# Altium schematic sheet Controller.SchDoc
size A3
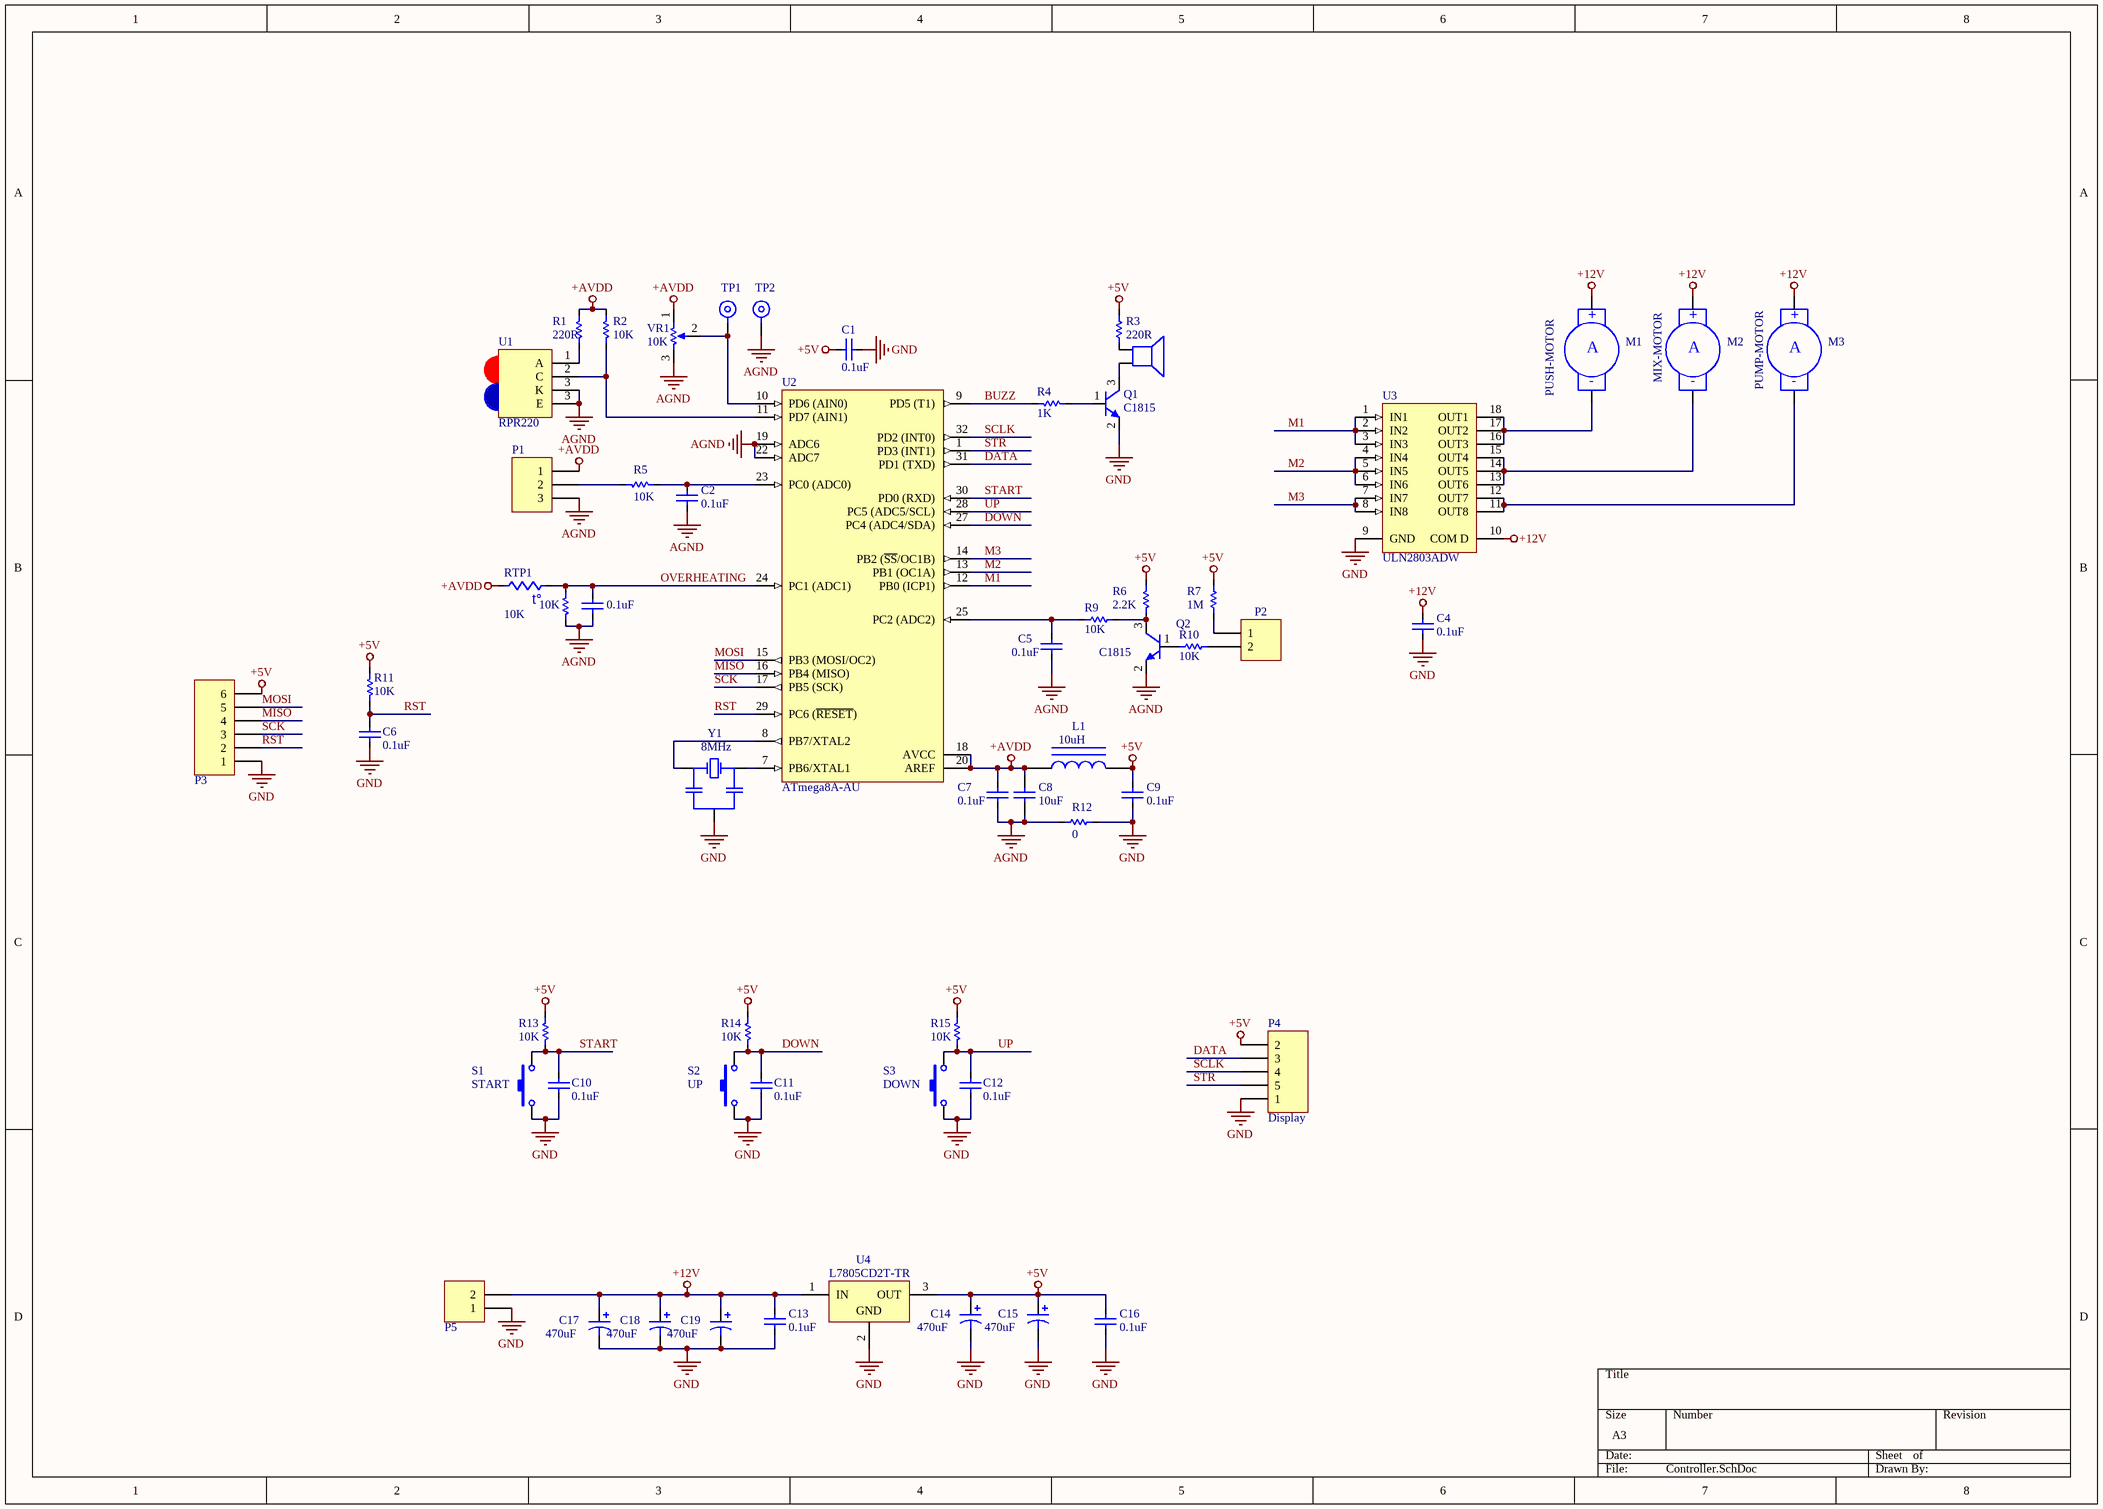
[diagram p0: Controller.SchDoc]

## Parts
C1  0.1uF  [C0805]
C2  0.1uF  [C0805]
C3  0.1uF  [C0805]
C4  0.1uF  [C0805]
C5  0.1uF  [C0805]
C6  0.1uF  [C0805]
C7  0.1uF  [C0805]
C8  10uF  [C0805]
C9  0.1uF  [C0805]
C10  0.1uF  [C0805]
C11  0.1uF  [C0805]
C12  0.1uF  [C0805]
C13  0.1uF  [C0805]
C14  470uF  [CAP-8x11.5]
C15  470uF  [CAP-8x11.5]
C16  0.1uF  [C0805]
C17  470uF  [CAP-8x11.5]
C18  470uF  [CAP-8x11.5]
C19  470uF  [CAP-8x11.5]
L1  10uH  [R0805]
LS1  Buzz  [BUZZ]  (value not drawn)
M1  PUSH-MOTOR  [CONN-2POS-PITCH2.54MM]
M2  MIX-MOTOR  [CONN-2POS-PITCH2.54MM]
M3  PUMP-MOTOR  [CONN-2POS-PITCH2.54MM]
P1  Header 3  [CONN-3POS-PITCH2.54MM]  (value not drawn)
P2  AC-PWR  [CONN-2POS-PITCH2.54MM]  (value not drawn)
P3  Header 6  [JP-H6B]  (value not drawn)
P4  Display  [CONN-5POS-PITCH2.54MM]
P5  AC-PWR  [CONN-2POS-PITCH2.54MM]  (value not drawn)
Q1  C1815  [SOT-23]
Q2  C1815  [SOT-23]
R1  220R  [R0805]
R2  10K  [R0805]
R3  220R  [R0805]
R4  1K  [R0805]
R5  10K  [R0805]
R6  2.2K  [R0805]
R7  1M  [R0805]
R8  10K  [R0805]
R9  10K  [R0805]
R10  10K  [R0805]
R11  10K  [R0805]
R12  0  [R0805]
R13  10K  [R0805]
R14  10K  [R0805]
R15  10K  [R0805]
RTP1  10K  [CONN-2POS-PITCH2.54MM]
S1  START  [BUTON-B3F]
S2  UP  [BUTON-B3F]
S3  DOWN  [BUTON-B3F]
TP1  Testpoint  [TP-SMD]  (value not drawn)
TP2  Testpoint  [TP-SMD]  (value not drawn)
U1  RPR220  [CONN-3POS-PITCH2.54MM]
U2  ATmega8A-AU  [32-TQFP]
U3  ULN2803ADW  [18-SOIC-W]
U4  L7805CD2T-TR  [TO-252-3]
VR1  10K  [RPOT-RM065]
Y1  8MHz  [XTA-CSTCE8M00G52-R0]

## Nets
+5V: C1.2 C9.2 C14.1 C15.1 C16.1 L1.2 P3.6 P4.2 R3.2 R6.1 R7.2 R11.2 R13.1 R14.1 R15.1 U2.4(VCC) U2.6(VCC) U4.3(OUT)
+12V: C4.1 C13.1 C17.1 C18.1 C19.1 M1.2(+) M2.2(+) M3.2(+) P5.2 U3.10(COM_D) U4.1(IN)
+AVDD: C7.2 C8.2 L1.1 P1.1 R1.1 R2.2 RTP1.2 U2.18(AVCC) U2.20(AREF) VR1.1(TOP)
AGND: C2.2 C3.2 C5.2 C7.1 C8.1 P1.3 Q2.2(B) R8.1 R12.2 TP2.1 U1.3(K) U2.19(ADC6) U2.22(ADC7) VR1.3(BOT)
GND: C1.1 C4.2 C6.2 C9.1 C10.2 C11.2 C12.2 C13.2 C14.2 C15.2 C16.2 C17.2 C18.2 C19.2 P3.1 P4.1 P5.1 Q1.2(B) R12.1 S1.2 S2.2 S3.2 U2.3(GND) U2.5(GND) U2.21(GND) U3.9(GND) U4.2(GND) Y1.2(OSC3)
BUZZ: R4.2 U2.9(PD5_(T1))
DATA: P4.3 U2.31(PD1_(TXD))
DOWN: C11.1 R14.2 S2.1 U2.27(PC4_(ADC4/SDA))
M1: U2.12(PB0_(ICP1)) U3.1(IN1) U3.2(IN2) U3.3(IN3)
M2: U2.13(PB1_(OC1A)) U3.4(IN4) U3.5(IN5) U3.6(IN6)
M3: U2.14(PB2_(~{SS}/OC1B)) U3.7(IN7) U3.8(IN8)
MISO: P3.4 U2.16(PB4_(MISO))
MOSI: P3.5 U2.15(PB3_(MOSI/OC2))
OVERHEATING: C3.1 R8.2 RTP1.1 U2.24(PC1_(ADC1))
RST: C6.1 P3.2 R11.1 U2.29(PC6_(~{RESET}))
SCK: P3.3 U2.17(PB5_(SCK))
SCLK: P4.4 U2.32(PD2_(INT0))
START: C10.1 R13.2 S1.1 U2.30(PD0_(RXD))
STR: P4.5 U2.1(PD3_(INT1))
UP: C12.1 R15.2 S3.1 U2.28(PC5_(ADC5/SCL))
NetC2_1: C2.1 R5.2 U2.23(PC0_(ADC0))
NetC5_1: C5.1 R9.2 U2.25(PC2_(ADC2))
NetLS1_1: LS1.1(+) R3.1
NetLS1_2: LS1.2(-) Q1.3(E)
NetM1_1: M1.1(-) U3.16(OUT3) U3.17(OUT2) U3.18(OUT1)
NetM2_1: M2.1(-) U3.13(OUT6) U3.14(OUT5) U3.15(OUT4)
NetM3_1: M3.1(-) U3.11(OUT8) U3.12(OUT7)
NetP1_2: P1.2 R5.1
NetP2_1: P2.1 R7.1
NetP2_2: P2.2 R10.1
NetQ1_1: Q1.1(C) R4.1
NetQ2_1: Q2.1(C) R10.2
NetQ2_3: Q2.3(E) R6.2 R9.1
NetR1_2: R1.2 U1.1(A)
NetR2_1: R2.1 U1.2(C) U2.11(PD7_(AIN1))
NetTP1_1: TP1.1 U2.10(PD6_(AIN0)) VR1.2(TAP)
NetU2_7: U2.7(PB6/XTAL1) Y1.3(OSC2)
NetU2_8: U2.8(PB7/XTAL2) Y1.1(OSC1)

Not connected (* = marked no-connect by the designer): U2 2(PD4_(XCK/T0)) 26(PC3_(ADC3))

## Notes on the sheet
- (in symbol Motor Servo) A
- (in symbol Res Thermal) t°

## Library data of the parts
C1-C7 C9-C13 C16 = Cap: CAP CER 0.1UF 50V 10% X7R 0805; Manufacturer: Kemet; Manufacturer Part Number: C0805C104K5RACTU; Digi-Key Part Number: 399-1170-1-ND; Link: http://www.digikey.com/product-detail/en/C0805C104K5RACTU/399-1170-1-ND/411445
C8 = Cap: CAP CER 10UF 25V 10% X5R 0805; Manufacturer Part Number: CL21A106KAYNNNE; Manufacturer: Samsung Electro-Mechanics America, Inc; Digi-Key Part Number: 1276-2891-1-ND; Link: http://www.digikey.com/product-detail/en/CL21A106KAYNNNE/1276-2891-1-ND/3890977
C14 C15 C17-C19 = Cap Pol1: CAP ALUM 100UF 20% 35V RADIAL; Manufacturer: Nichicon; Manufacturer Part Number: UVR1V102MHD; Link: http://www.digikey.com/product-detail/en/UVR1V102MHD/493-1085-ND/588826; Digi-Key Part Number: 493-1085-ND
L1 = Inductor Iron: FERRITE CHIP 10uH 0805; Manufacturer: Murata Electronics North America; Manufacturer Part Number: BLM21BD121SN1D; Link: http://www.digikey.com/product-detail/en/BLM21BD121SN1D/490-1044-1-ND/584491; Digi-Key Part Number: 490-1044-1-ND
LS1 = Speaker: BUZZER PIEZO 2KHZ 14MM PC MOUNT; Manufacturer Part Number: PS1420P02CT; Manufacturer: TDK Corporation; Link: http://www.digikey.com/product-detail/en/PS1420P02CT/445-2526-1-ND/935931; Digi-Key Part Number: 445-2526-1-ND
M1-M3 = Motor Servo: Servo Motor
P1 = Header 3: Header, 3-Pin
P2 P5 = Header 2: CONN IDC HOUSING 2POS 20AWG SMD; Manufacturer Part Number: 1-2106003-2; Manufacturer: TE Connectivity; Digi-Key Part Number: A100350CT-ND; Link: http://www.digikey.com/product-detail/en/1-2106003-2/A100350CT-ND/2224953
P3 = Header 6: Header, 6-Pin
P4 = Header 5: Header, 5-Pin
Q1 Q2 = NPN: TRANS NPN 50V 0.15A TO-92; Manufacturer: Fairchild Semiconductor; Manufacturer Part Number: KSC1815YTA; Link: http://www.digikey.com/product-detail/en/KSC1815YTA/KSC1815YTACT-ND/3908203; Digi-Key Part Number: KSC1815YTACT-ND
R1 R3 = Res1: 220 OHM 1/8W 1% 0805 SMD; Manufacturer: Yageo; Manufacturer Part Number: RC0805FR-07220RL; Digi-Key Part Number: 311-220CRCT-ND; Link: http://www.digikey.com/product-detail/en/RC0805FR-07220RL/311-220CRCT-ND/730688
R2 R5 R8 R11 = Res1: RES 100 OHM 1W 5% AXIAL
R4 = Res1: 1K OHM 1/8W 1% 0805 SMD; Manufacturer: Panasonic Electronic Components; Manufacturer Part Number: ERJ-6ENF1001V; Digi-Key Part Number: P1.00KCCT-ND; Link: http://www.digikey.com/product-detail/en/ERJ-6ENF1001V/P1.00KCCT-ND/118957
R6 = Res1: RES SMD 2.2K OHM 1% 1/8W 0805; Manufacturer: Panasonic Electronic Components; Manufacturer Part Number: ERJ-6ENF2201V; Digi-Key Part Number: P2.20KCCT-ND; Link: http://www.digikey.com/product-detail/en/ERJ-6ENF2201V/P2.20KCCT-ND/1746832
R7 = Res1: RES SMD 1M OHM 1% 1/8W 0805; Manufacturer: Yageo; Manufacturer Part Number: RC0805FR-071ML; Link: http://www.digikey.com/product-detail/en/RC0805FR-071ML/311-1.00MCRCT-ND/730392; Digi-Key Part Number: 311-1.00MCRCT-ND
R9 R10 = Res1: RES 10K OHM 1/8W .1% 0805 SMD; Manufacturer: Panasonic Electronic Components; Manufacturer Part Number: ERA-6AEB103V; Link: http://www.digikey.com/product-detail/en/ERA-6AEB103V/P10KDACT-ND/1465971?cur=USD; Digi-Key Part Number: P10KDACT-ND
R12 = Res1: RES SMD 0.0 OHM JUMPER 1/8W 0805; Manufacturer: Yageo; Manufacturer Part Number: RC0805FR-070RL; Link: http://www.digikey.com/product-detail/en/RC0805FR-070RL/311-0.0CRCT-ND/2827937; Digi-Key Part Number: 311-0.0CRCT-ND
R13-R15 = Res1: RES 10K OHM 1/8W 1% 0805 SMD; Manufacturer Part Number: ERJ-6ENF1002V; Manufacturer: Panasonic Electronic Components; Digi-Key Part Number: P10.0KCCT-ND; Link: http://www.digikey.com/product-detail/en/ERJ-6ENF1002V/P10.0KCCT-ND/119248
RTP1 = Res Thermal: THERMISTOR 10K OHM 40MM L NTC; Manufacturer Part Number: NXRT15XH103FA1B040; Manufacturer: Murata Electronics North America; Digi-Key Part Number: 490-7167-ND; Link: http://www.digikey.com/product-detail/en/NXRT15XH103FA1B040/490-7167-ND/3900399
S1-S3 = SW-PB: SWITCH TACTILE SPST-NO 0.05A 12V; Manufacturer Part Number: FSM101; Manufacturer: TE Connectivity; Digi-Key Part Number: 450-1157-ND; Link: http://www.te.com/commerce/DocumentDelivery/DDEController?Action=srchrtrv&DocNm=1571140&DocType=Customer+Drawing&DocLang=English
TP1 TP2 = TP1
U1 = RPR220: PHOTOINTERRUPTER REFL 6MM 800NM; Manufacturer: Rohm Semiconductor; Manufacturer Part Number: RPR-220; Link: http://www.digikey.com/product-detail/en/RPR-220/511-1366-ND/638554; Digi-Key Part Number: 511-1366-ND
U2 = ATmega8A-AU: IC MCU 8BIT 8KB FLASH 32TQFP; Manufacturer: Atmel; Manufacturer Part Number: ATMEGA8L-8AU; Link: http://www.digikey.com/product-detail/en/ATMEGA8L-8AU/ATMEGA8L-8AU-ND/739788; Digi-Key Part Number: ATMEGA8L-8AU-ND
U3 = ULN2803LW: TRANS 8NPN DARL 50V 0.5A 18SO; Link: http://www.digikey.com/product-detail/en/ULN2803ADW/ULN2803ADW-ND/1912658; Digi-Key Part Number: ULN2803ADW-ND
U4 = MC7805CT: IC REGULATOR POS 5V D2PAK; Manufacturer: STMicroelectronics; Manufacturer Part Number: L7805CD2T-TR; Link: http://www.digikey.com/product-detail/en/L7805CD2T-TR/497-1171-1-ND/586171; Digi-Key Part Number: 497-1171-1-ND
VR1 = RPot: TRIMMER 10K OHM 0.5W TH; Manufacturer: Murata Electronics North America; Manufacturer Part Number: PV36W103C01B00; Link: http://www.digikey.com/product-detail/en/PV36W103C01B00/490-2875-ND/666502; Digi-Key Part Number: 490-2875-ND
Y1 = XTAL-CSTCE8M00G52-R0: CER RESONATOR 20.0MHZ SMD; Link: http://www.digikey.com/product-detail/en/CSTCE20M0V53-R0/490-1199-1-ND/584636; Digi-Key Part Number: 490-1199-1-ND